# EAGLE design n24cape_rev_a (EAGLE 7.3.0)
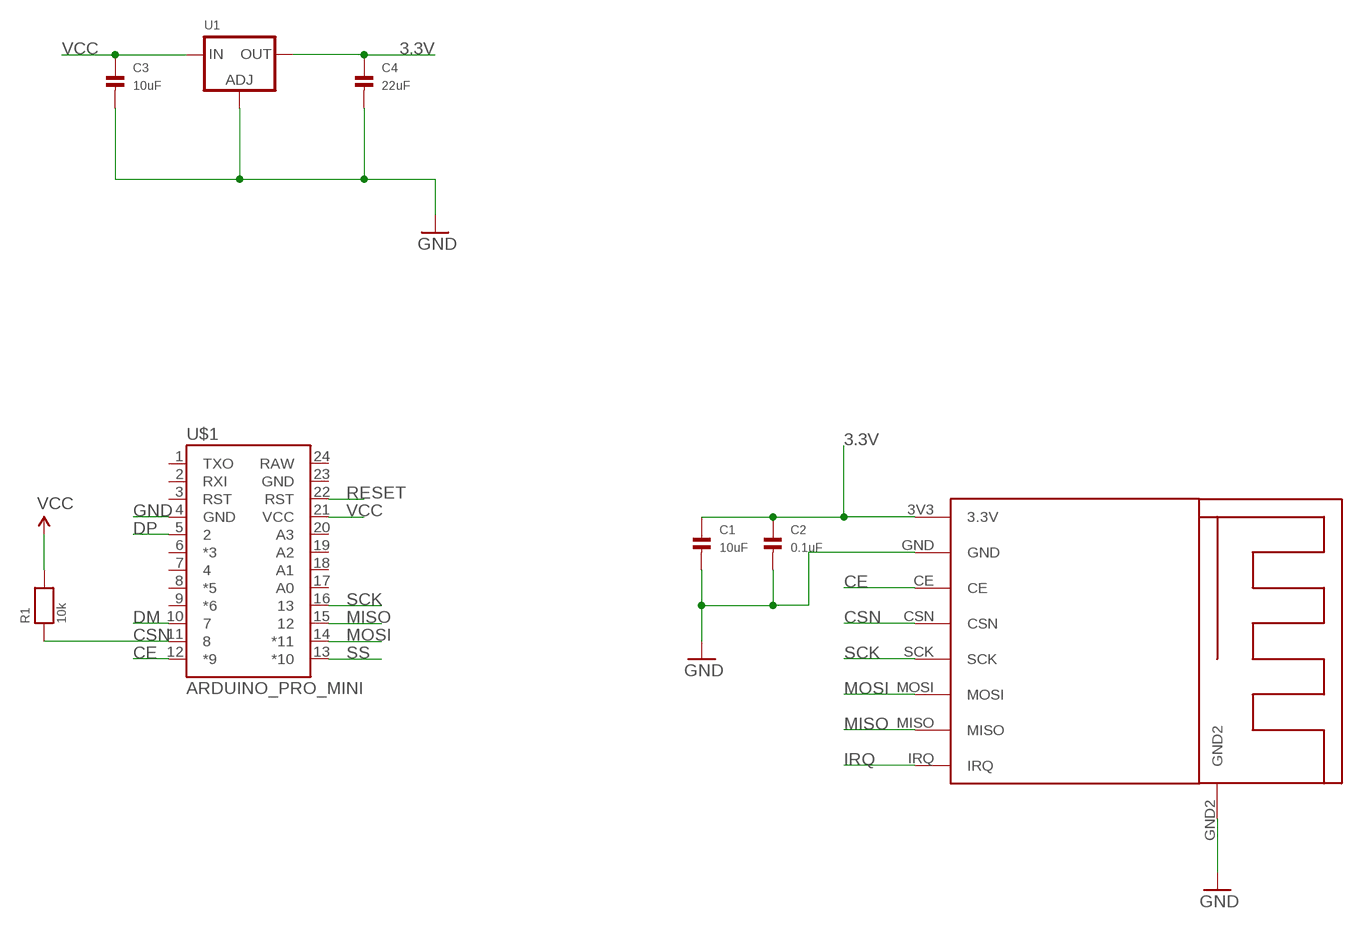
[diagram p0: schematic, sheet 1]

## Parts
C1  10uF  CAP_CERAMIC0603MINI  [0603-MINI]
C2  0.1uF  CAP_CERAMIC0603MINI  [0603-MINI]
C3  10uF  CAP_CERAMIC0603MINI  [0603-MINI]
C4  22uF  CAP_CERAMIC0603MINI  [0603-MINI]
R1  10k  RESISTOR_0603  [_0603]
U1  LM1117SOT223-REFLOW  [SOT223-R]
U$1  ARDUINO_PRO_MINI  [ARDUINO_PRO_MINI]
U$3  NRF24MINI  [NRF24MINI]

## Nets
3.3V: C1.1 C2.1 C4.1 U1.2(OUT) U1.4(OUT) U$3.3V3(3.3V)
CE: U$1.12(*9) U$3.CE
CSN: R1.1 U$1.11 U$3.CSN
DM: U$1.10
DP: U$1.5
GND: C1.2 C2.2 C3.2 C4.2 U1.1(ADJ) U$1.4(GND) U$3.GND U$3.GND2
IRQ: U$3.IRQ
MISO: U$1.15 U$3.MISO
MOSI: U$1.14(*11) U$3.MOSI
RESET: U$1.22(RST)
SCK: U$1.16 U$3.SCK
SS: U$1.13(*10)
VCC: C3.1 R1.2 U1.3(IN) U$1.21(VCC)
Unconnected: U$1.1(TXO) U$1.2(RXI) U$1.3(RST) U$1.6(*3) U$1.7 U$1.8(*5) U$1.9(*6) U$1.17(A0) U$1.18(A1) U$1.19(A2) U$1.20(A3) U$1.23(GND) U$1.24(RAW)

## Library data of the parts
C1-C4 = microbuilder:CAP_CERAMIC: Ceramic Capacitors 0402 - 0402 Surface Mount Capacitors 16pF 50V 5% [Digikey: 445-4899-2-ND] 18pF 50V 5% [Digikey: 490-1281-2-ND] 22pF 50V 5% [Digikey: 490-1283-2-ND] 68pF 50V 5% [Digikey: 490-1289-2-ND] 0.1uF 10V 10% [Digikey: 490-1318-2-ND] 1.0uF 6.3V 10% [Digikey: 490-1320-2-ND] 0603 - 0603 Surface Mount Capacitors 16 pF 50V 5% [Digikey: 445-5051-2-ND] 22 pF 50V [Digikey: PCC220ACVTR-ND] 33 pF 50V 5% [Digikey: 490-1415-1-ND] 56pF 50V 5% [Digikey: 490-1421-1-ND] 220pF 50V 5% [Digikey: 445-1285-1-ND] 680 pF 50V 2200 pF 50V 5% C0G [Digikey: 445-1297-1-ND] 5600 pF 100V 5% X7R [Digikey: 478-3711-1-ND] 0.1 µF 25V 10% [Digikey: PCC2277TR-ND] 0.22 µF 16V 10% X7R [Digikey: 445-1318-1-ND] 1.0 µF 25V 10% [Digikey: 445-5146-2-ND] 0603 - RF Specific 3pF 250V +/-0.1pF RF [Digikey: 712-1347-1-ND] 18 pF 250V 5% [Digikey: 478-3505-1-ND or 712-1322-1-ND] 56 pF 250V 5% C0G RF [Digikey: 490-4867-1-ND] 68 pF 250V RF [Digikey: 490-4868-1-ND] 0805 - 0805 Surface Mount Capacitors 220 pF 250V 2% RF Ceramic Capacitor [Digikey: 712-1398-1-ND] 1000 pF 50V 2% NP0 Ceramic Capacitor [Digikey: 478-3760-1-ND] 0.1 µF 25V 10% Ceramic Capacitor [Digikey: PCC1828TR-ND] 1.0 µF 16V 10% Ceramic Capacitor[Digikey: 490-1691-2-ND] 10.0 µF 10V 10% Ceramic Capacitor[Digikey: 709-1228-1-ND] 10.0 uF 16V 10% Ceramic Capacitor [Digikey: 478-5165-2-ND] 47 uF 6.3V 20% Ceramic Capacitor [Digikey: 587-1779-1-ND or 399-5506-1-ND] 1206 - 1206 Surface Mount Capacitors 47uF 10V 20% Ceramic Capacitor [Digikey: 490-5528-1-ND or 399-5508-1-ND or 445-6010-1-ND] 100uF 6.3V -20%, +80% Y5V Ceramic Capacitor (Digikey: 490-4512-1-ND, Mouser: 81-GRM31CF50J107ZE1L)
R1 = microbuilder:RESISTOR: Resistors 0402 - 0402 Surface Mount Package 22 Ohm 1% 1/16W [Digikey: 311-22.0LRTR-ND] 33 Ohm 5% 1/16W 1.0K 5% 1/16W 1.5K 5% 1/16W 2.0K 1% 1/16W 10.0K 1% 1/16W [Digikey: 311-10.0KLRTR-ND] 10.0K 5% 1/16W [Digikey: RMCF0402JT10K0TR-ND] 12.1K 1% 1/16W [Digikey: 311-22.0LRTR-ND] 100.0K 5% 1/16W 0603 - 0603 Surface Mount Package 0 Ohm 1/10 Watt 1% Resistor 15 Ohm 1/10 Watt 1% Resistor 33 Ohm 1/10 Watt 1% Resistor 49.9 Ohm 1/10 Watt 1% Resistor 100 Ohm 1/10 Watt 1% Resistor 150 Ohm 1/10 Watt 1% Resistor 240 Ohm 1/10 Watt 1% Resistor 390 Ohm 1/10 Watt 1% Resistor 560 Ohm 1/10 Watt 1% Resistor 680 Ohm 1/10 Watt 1% Resistor 750 Ohm 1/10 Watt 1% Resistor 1.0K Ohm 1/10 Watt 1% Resistor 1.5K Ohm 1/10 Watt 1% Resistor 2.0K Ohm 1/10 Watt 1% Resistor 2.2K Ohm 1/10 Watt 1% Resistor 3.3K Ohm 1/10 Watt 1% Resistor 4.7K Ohm 1/10 Watt 1% Resistor 10.0K Ohm 1/10 Watt 1% Resistor 12.0K Ohm 1/10 Watt 1% Resistor 12.1K Ohm 1/10 Watt 1% Resistor 20.0K Ohm 1/10 Watt 1% Resistor 33.0K Ohm 1/10 Watt 1% Resistor 100.0K Ohm 1/10 Watt 1% Resistor 0805 - 0805 Surface Mount Package 0 Ohm 1/8 Watt 1% Resistor 33 Ohm 1/8 Watt 1% Resistor 100 Ohm 1/8 Watt 1% Resistor 150 Ohm 1/8 Watt 1% Resistor 200 Ohm 1/8 Watt 1% Resistor 240 Ohm 1/8 Watt 1% Resistor 330 Ohm 1/8 Watt 1% Resistor 390 Ohm 1/8 Watt 1% Resistor 470 Ohm 1/8 Watt 1% Resistor 1.0K Ohm 1/8 Watt 1% Resistor 1.5K Ohm 1/8 Watt 1% Resistor 2.0K Ohm 1/8 Watt 1% Resistor 4.7K Ohm 1/8 Watt 1% Resistor 5.1K Ohm 1/8 Watt 1% Resistor 5.6K Ohm 1/8 Watt 1% Resistor 10.0K Ohm 1/8 Watt 1% Resistor 22.0K Ohm 1/8 Watt 1% Resistor 33.0K Ohm 1/8 Watt 1% Resistor 100K Ohm 1/8 Watt 1% Resistor 1206 - 1206 Surface Mount Package 2012 - 2010 Surface Mount Package 0.11 Ohm 1/2 Watt 1% Resistor - Digikey: RHM.11UCT-ND
U1 = microbuilder:LM1117: LM1117 Voltage Regulator LM1117 Adjustable Voltage regulator [Digikey: LM1117IMP-ADJDKR-ND] LM1117 3.3V Voltage regulator [AP1117E33GDIDKR-ND] LM1117 5.0V Voltage regulator [AP1117E50GDIDKR-ND] SOT223-REFLOW - SOT223 package for solder paste/reflow ovens SOT223-WAVE - SOT223 package for hand-soldering (larger pads) Note: For the fixed-voltage regulators, simply set the ADJ pin to GND.
U$1 = SparkFun-Boards:ARDUINO_PRO_MINI
U$3 = nrf24mini:NRF24MINI

## Board
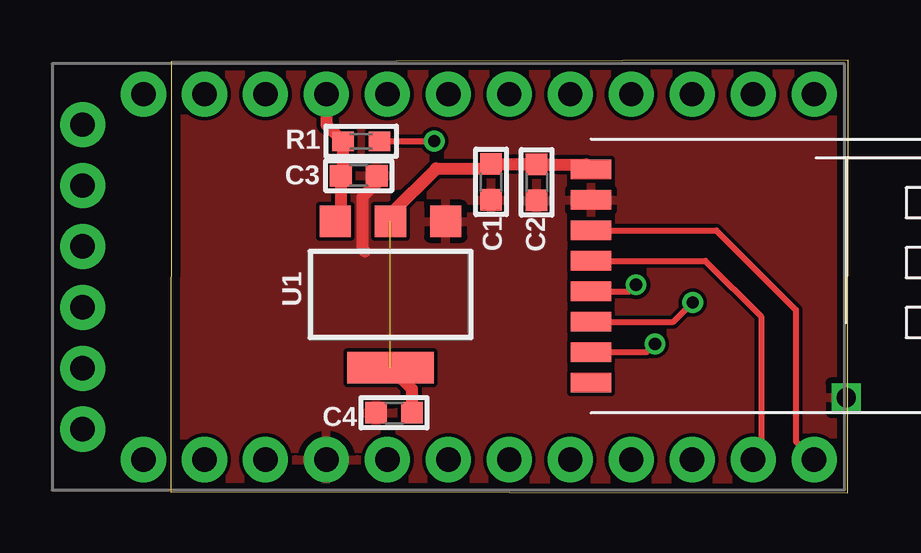
[diagram p1: board, top side]
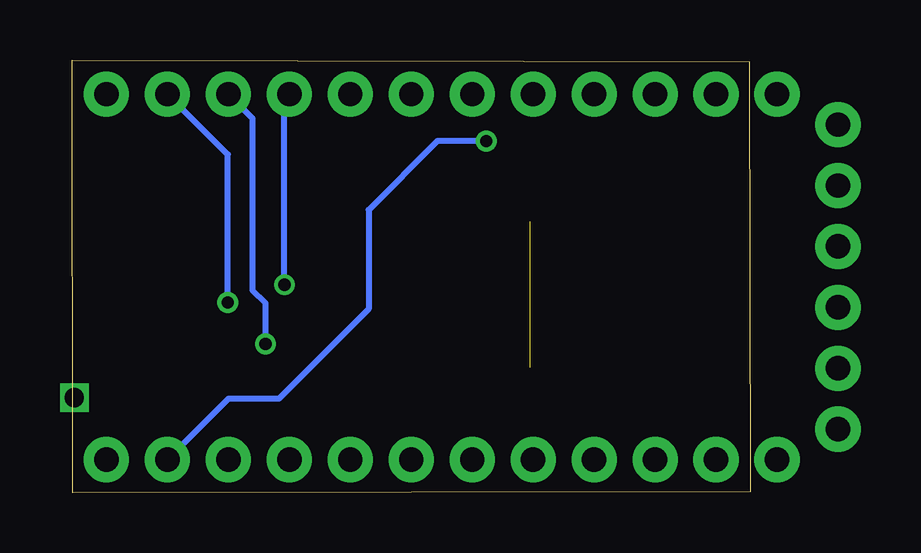
[diagram p2: board, bottom side, seen from below]

Size 28.25 x 18.04 mm. Coordinates in mm from the lower left corner, seen from the top.
Outline: 0,0.02 28.22,0 28.25,18.04 0.02,17.97 0,0.02
Copper layers (1*16): Top 0.0356mm / dielectric 1.5011mm / Bottom 0.0356mm
Design rules "PCBs_io": minimum track width 6mil, minimum drill 13mil, track to track 6mil, track to pad 6mil, pad to pad 6mil, via to via 6mil, smd to smd 6mil, copper to edge 15mil, drill to drill 6mil, minimum pad ring 7mil, minimum via ring 7mil, stop-mask expansion 3mil, vias tented up to drill 0mil, thermal gap 10mil

### Footprints (pad centres in the part's own frame; a part is rotated, then mirrored left to right if it is on the bottom)
0603-MINI = smd 0.9 x 0.9: 1 -0.75,0; 2 0.75,0
_0603 = smd 0.9 x 0.8: 1 -0.762,0; 2 0.762,0
SOT223-R = smd 1.3 x 1.3: 1 -2.3,-3.05; 2 0,-3.05; 3 2.3,-3.05 | smd 3.6 x 1.3: 4 0,3.05
ARDUINO_PRO_MINI = drill 1.016 pad 1.88: 1 -7.62,12.7; 2 -7.62,10.16; 3 -7.62,7.62; 4 -7.62,5.08; 5 -7.62,2.54; 6 -7.62,0; 7 -7.62,-2.54; 8 -7.62,-5.08; 9 -7.62,-7.62; 10 -7.62,-10.16; 11 -7.62,-12.7; 12 -7.62,-15.24; 13 7.62,-15.24; 14 7.62,-12.7; 15 7.62,-10.16; 16 7.62,-7.62; 17 7.62,-5.08; 18 7.62,-2.54; 19 7.62,0; 20 7.62,2.54; 21 7.62,5.08; 22 7.62,7.62; 23 7.62,10.16; 24 7.62,12.7; BLK -6.35,15.24; GND -3.81,15.24; GRN 6.35,15.24; RXI 1.27,15.24; TXO 3.81,15.24; VCC -1.27,15.24
NRF24MINI = smd 1.676 x 0.813: 3V3 0,8.89; CE 0,6.35; CSN 0,5.08; GND 0,7.62; IRQ 0,0; MISO 0,1.27; MOSI 0,2.54; SCK 0,3.81 | drill 0.8 square: GND2 10.625,-0.625

### Placement (x,y rotation side)
C1  13.36,12.95 270 top
C2  15.26,12.93 270 top
C3  7.84,13.22 0 top
C4  9.32,3.33 180 top
R1  7.95,14.65 180 top
U1  9.17,8.26 180 top
U$1  11.58,8.99 90 top
U$3  17.53,4.58 0 top

### Tracks (layer width: path | path; a pad name or v marks a point on that pad's centre or on a via)
3.3V  (1 unrouted)
  Top 0.381: 13.34,13.72 C1.1
  Top 0.508: U1.2 9.17,11.61 11.07,13.52 13.17,13.52 C1.1 15.23,13.7 C2.1 17.32,13.68 U$3.3V3 | C4.1 10.07,4.31 U1.4
CE
  Top 0.254: U$3.CE 22.74,10.93 26.05,7.62 26.05,2.14 U$1.12
CSN  (via drill 0.51)
  Top 0.254: U$3.CSN 22.29,9.66 24.61,7.34 24.61,1.7 U$1.11 | R1.1 v10.98,14.65 v10.99,14.66
  Bottom 0.254: v10.99,14.66 13.02,14.66 15.89,11.79 15.89,7.65 19.63,3.91 21.73,3.91 U$1.11
GND
  Top 0.508: C3.2 8.59,12.92 7.99,12.32 7.99,10.16 8.1,10.06
  pour Top: -4.78,17.94 27.57,17.94 27.57,0.13 -4.78,0.13
MISO  (via drill 0.51)
  Top 0.254: U$3.MISO 19.84,5.85 v20.19,6.2
  Bottom 0.254: v20.19,6.2 20.19,7.9 20.72,8.44 20.72,15.6 U$1.15
MOSI  (via drill 0.51)
  Top 0.254: U$3.MOSI 20.96,7.12 v21.76,7.93
  Bottom 0.254: v21.76,7.93 21.76,14.1 U$1.14
SCK  (via drill 0.51)
  Top 0.254: U$3.SCK 19.13,8.39 v19.4,8.66
  Bottom 0.254: v19.4,8.66 19.4,16.41 U$1.16
VCC
  Top 0.508: U$1.21 6.5,15.34 R1.2 7.18,13.31 C3.1 7.09,11.54 U1.3